# EAGLE schematic digital_module (EAGLE 7.4.0)
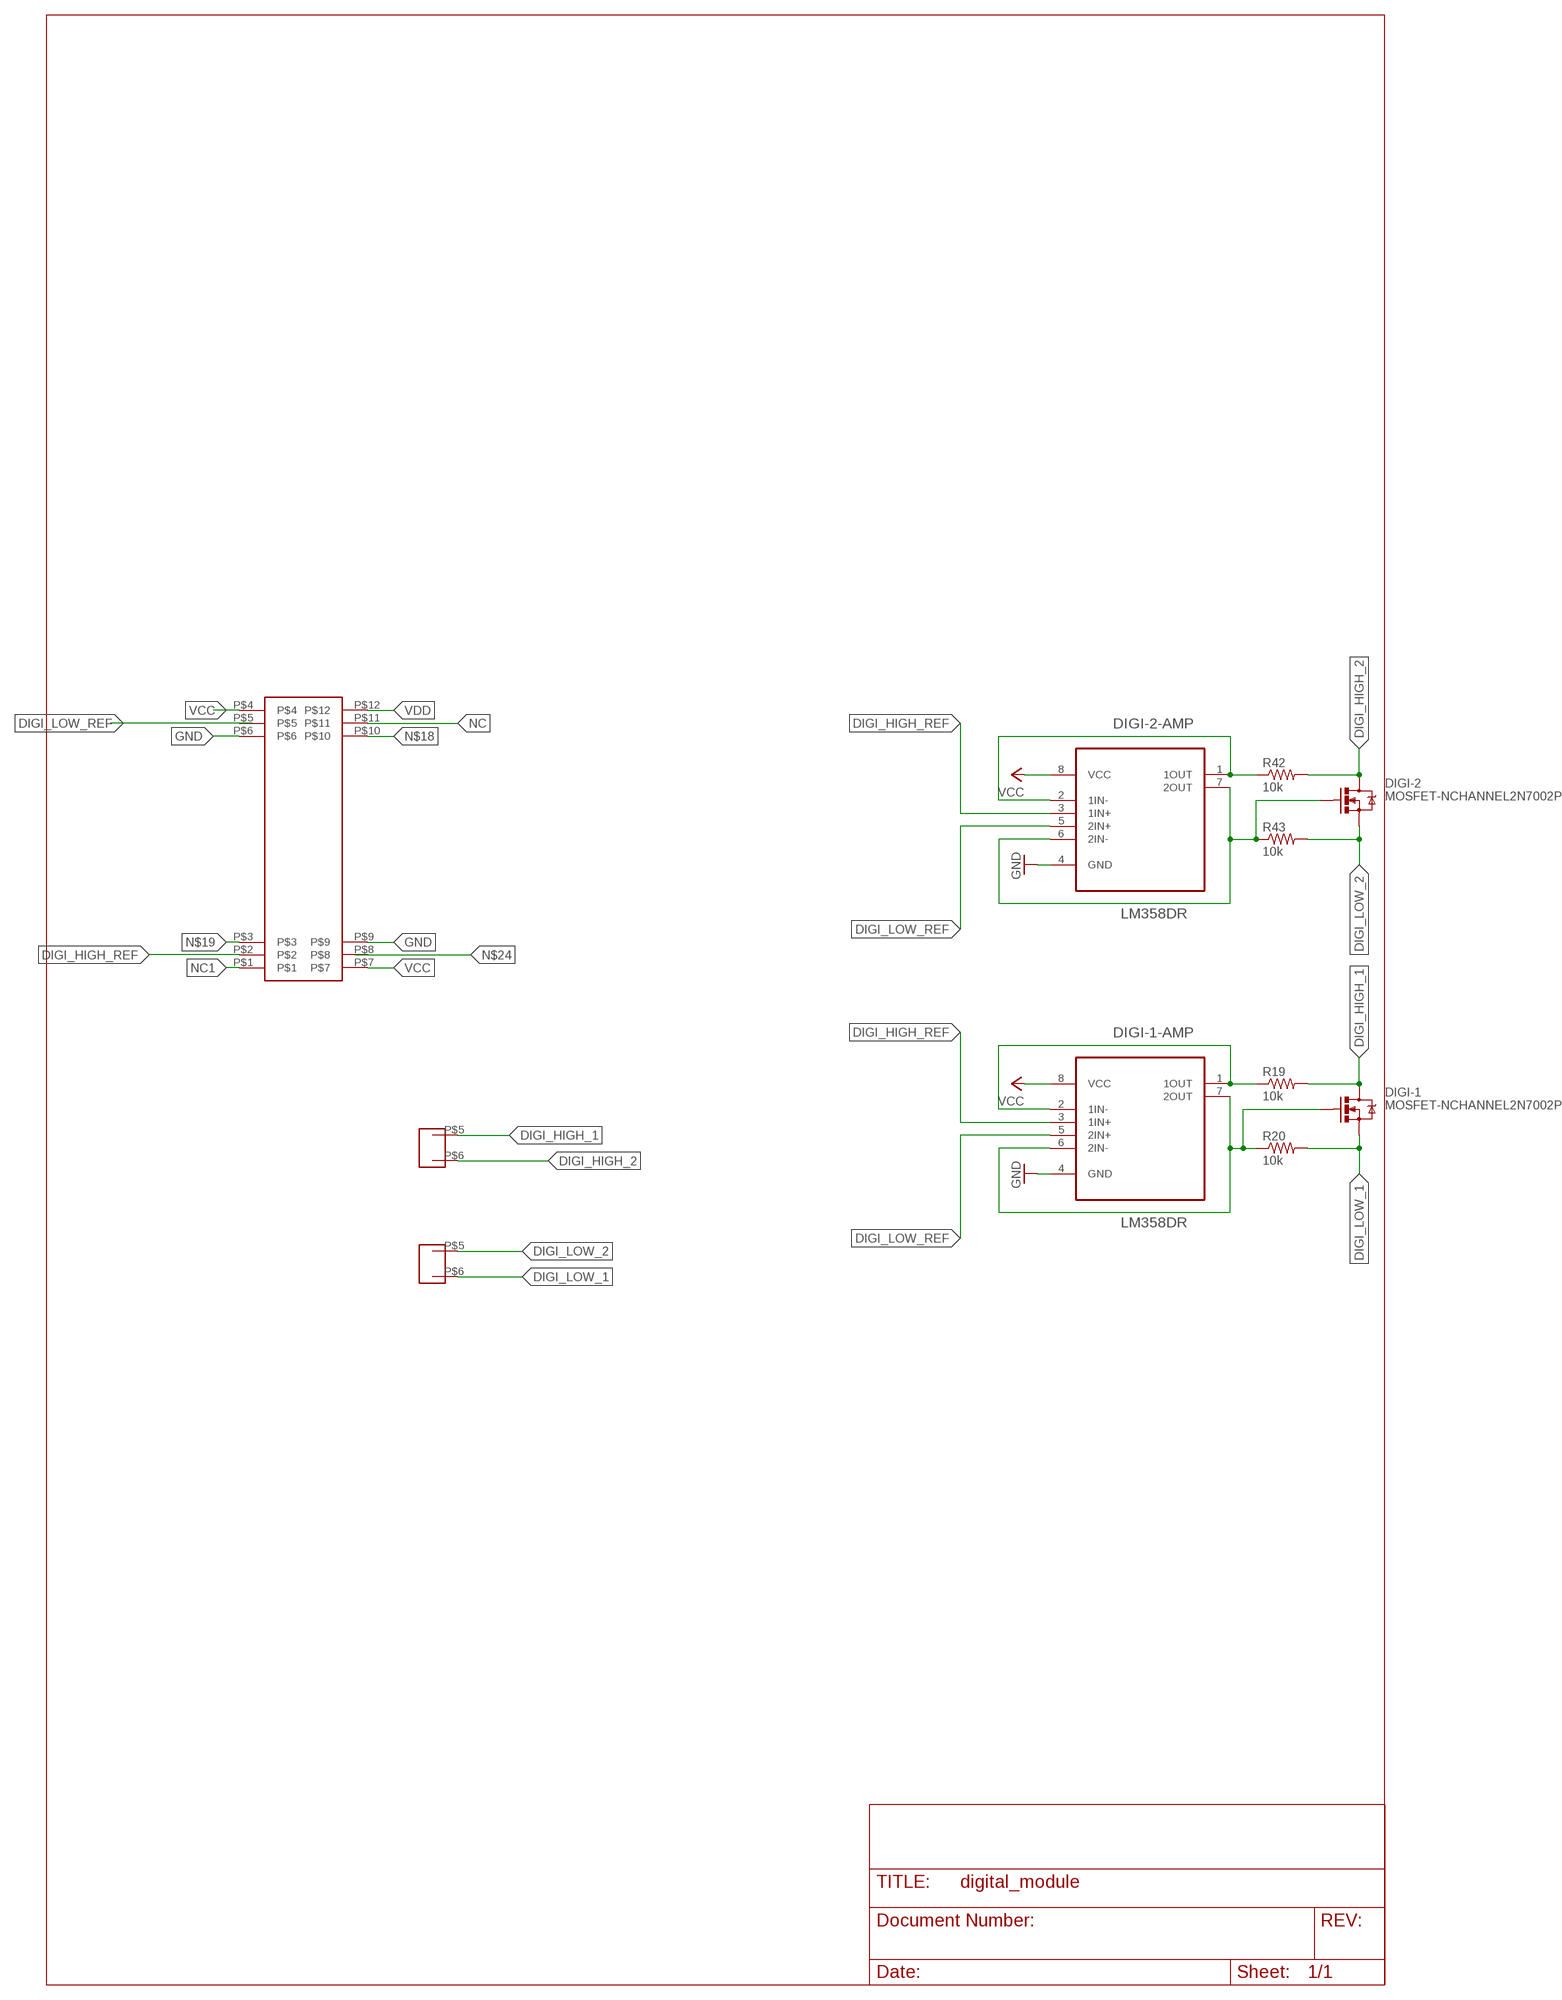
[diagram p0: schematic, sheet 1]

## Parts
DIGI-1  MOSFET-NCHANNEL2N7002PW  [SOT323]
DIGI-1-AMP  LM358DR  [SOIC127P600X175-8N]
DIGI-2  MOSFET-NCHANNEL2N7002PW  [SOT323]
DIGI-2-AMP  LM358DR  [SOIC127P600X175-8N]
R19  10k  R-US_R0805  [R0805]
R20  10k  R-US_R0805  [R0805]
R42  10k  R-US_R0805  [R0805]
R43  10k  R-US_R0805  [R0805]
U$1  MODULE_CONNECTOR  [MODULE_CONNECTOR]
U$2  5.08PITCHTERMINAL  [10KPL508]
U$3  5.08PITCHTERMINAL  [10KPL508]

## Nets
DI-1: DIGI-1-AMP.1(1OUT) DIGI-1-AMP.2(1IN-) R19.1
DIGI_HIGH_1: DIGI-1.3(D) R19.2 U$2.P$5
DIGI_HIGH_2: DIGI-2.3(D) R42.2 U$2.P$6
DIGI_HIGH_REF: DIGI-1-AMP.3(1IN+) DIGI-2-AMP.3(1IN+) U$1.P$2
DIGI_LOW_1: DIGI-1.2(S) R20.2 U$3.P$6
DIGI_LOW_2: DIGI-2.2(S) R43.2 U$3.P$5
DIGI_LOW_REF: DIGI-1-AMP.5(2IN+) DIGI-2-AMP.5(2IN+)
GND: DIGI-1-AMP.4(GND) DIGI-2-AMP.4(GND) U$1.P$6 U$1.P$9
N$8: DIGI-1-AMP.6(2IN-) DIGI-1-AMP.7(2OUT) DIGI-1.1(G) R20.1
N$18: U$1.P$10
N$19: U$1.P$3
N$63: DIGI-2-AMP.1(1OUT) DIGI-2-AMP.2(1IN-) R42.1
N$64: DIGI-2-AMP.6(2IN-) DIGI-2-AMP.7(2OUT) DIGI-2.1(G) R43.1
NC: U$1.P$11
NC1: U$1.P$1
VCC: DIGI-1-AMP.8(VCC) DIGI-2-AMP.8(VCC) U$1.P$4 U$1.P$7
VDD: U$1.P$12
Unconnected: U$1.P$5 U$1.P$8

## Library data of the parts
DIGI-1 DIGI-2 = SparkFun-DiscreteSemi:MOSFET-NCHANNEL: Common NMOSFET Parts MFG P/N Store ID Prod ID FDD8780 TRANS-09984 SI7820DN TRANS-11055 FDS6630A IC-08089 2N7002PW TRANS-11151 FQP30N06L COM-10213 TRANS-10060 BSS123LT1G TRANS-08345 BSS138 TRANS-00830 BS170 2N7000; PROD_ID: TRANS-11151
DIGI-1-AMP DIGI-2-AMP = Texas Instruments_By_element14_Batch_1:LM358DR: OPERATIONAL AMPLIFIERS; MPN: LM358DR; OC_FARNELL: 1831865; OC_NEWARK: 34K7599; PACKAGE: SOIC-8; SUPPLIER: Texas Instruments
R19 R20 R42 R43 = rcl:R-US_: RESISTOR, American symbol
U$1 = UADIVOLECO_module_connector:MODULE_CONNECTOR
U$2 U$3 = ruuviliitin_2pin:5.08PITCHTERMINAL